# Altium schematic sheet IMU-SD Card-CAN-CH340.SchDoc
size A4; SheetNumber: 9; SheetTotal: 10
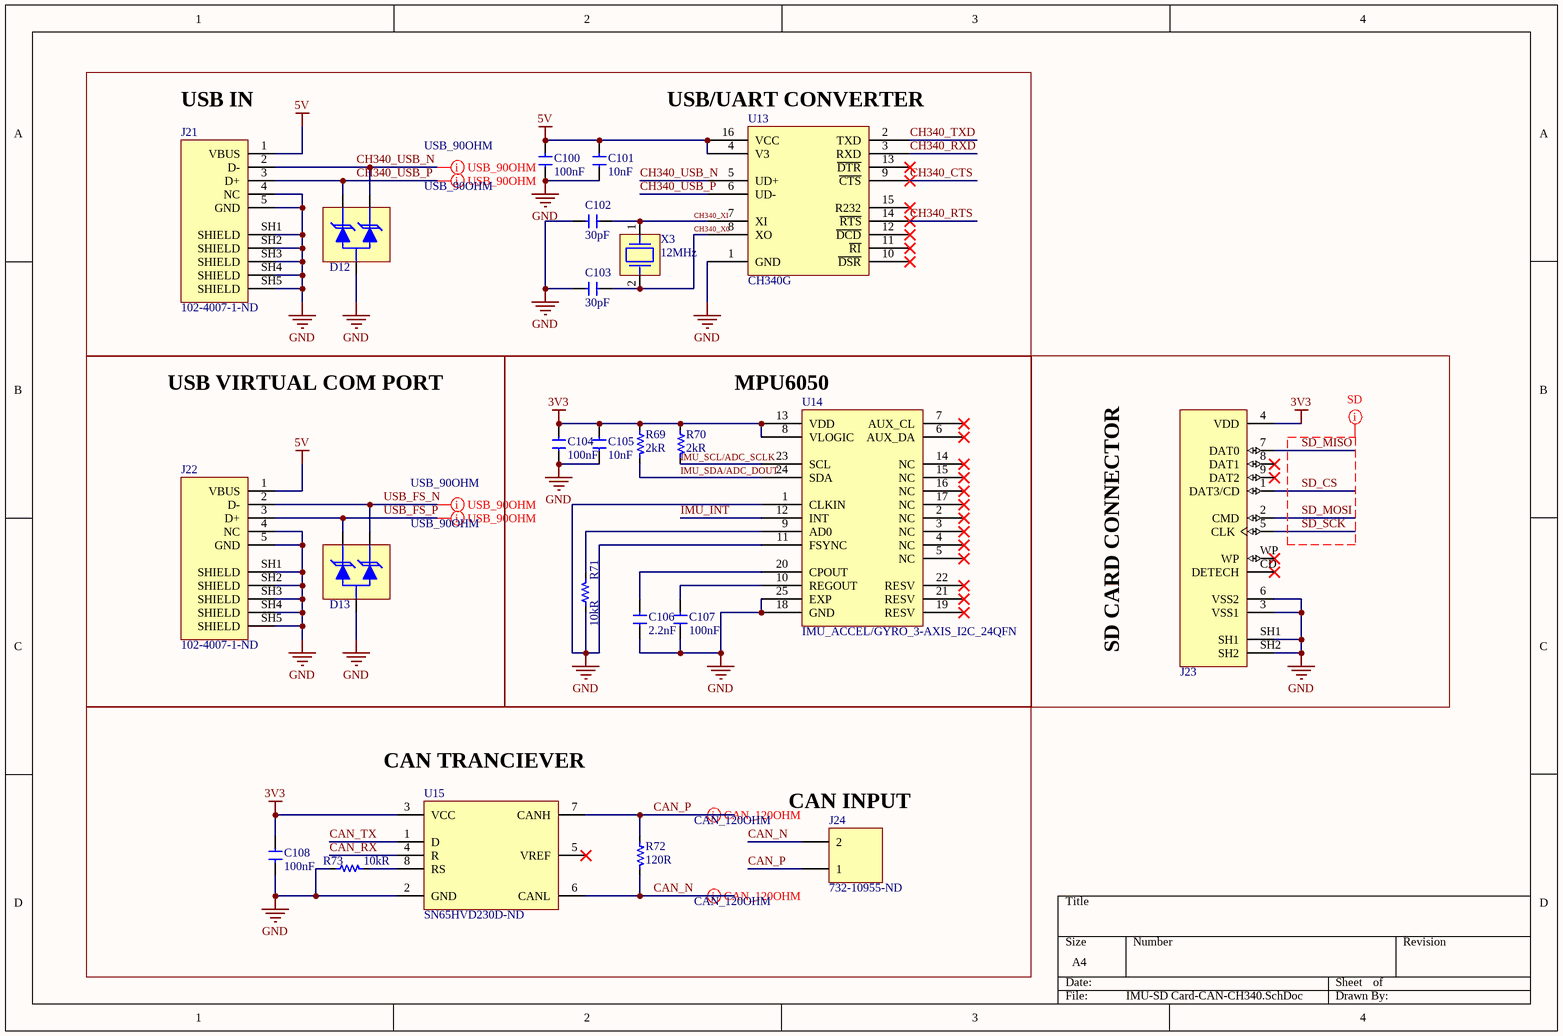
[diagram p0: IMU-SD Card-CAN-CH340.SchDoc]

## Parts
C100  Capacitance: 100nF  [0805_CAP]  (hidden comment: CAP_0.1uF_%20_50V_0805_X7R_CER)
C101  Capacitance: 10nF  [0805_CAP]  (hidden comment: CAP_10nF_%10_50V_0805_X7R_CER)
C102  Capacitance: 30pF  [0805_CAP]  (hidden comment: CAP_30pF_%5_50V_0805_C0G/NP0_CER)
C103  Capacitance: 30pF  [0805_CAP]  (hidden comment: CAP_30pF_%5_50V_0805_C0G/NP0_CER)
C104  Capacitance: 100nF  [0805_CAP]  (hidden comment: CAP_0.1uF_%20_50V_0805_X7R_CER)
C105  Capacitance: 10nF  [0805_CAP]  (hidden comment: CAP_10nF_%10_50V_0805_X7R_CER)
C106  Capacitance: 2.2nF  [0805_CAP]  (hidden comment: CAP_2200pF_%10_50V_0805_X7R_CER)
C107  Capacitance: 100nF  [0805_CAP]  (hidden comment: CAP_0.1uF_%20_50V_0805_X7R_CER)
C108  Capacitance: 100nF  [0805_CAP]  (hidden comment: CAP_0.1uF_%20_50V_0805_X7R_CER)
D12  DIODE_TVS_3.3VWM_8VC_SOT23  [SOT170P237X110-3N]  (value not drawn)
D13  DIODE_TVS_3.3VWM_8VC_SOT23  [SOT170P237X110-3N]  (value not drawn)
J21  Supplier Part Number 1: 102-4007-1-ND  [MICRO_USB2.0_CUI_UJ2-MIBH2-4-SMT]  (hidden comment: Micro USB2.0)
J22  Supplier Part Number 1: 102-4007-1-ND  [MICRO_USB2.0_CUI_UJ2-MIBH2-4-SMT]  (hidden comment: Micro USB2.0)
J23  CONN_SD CARD_L-KLS1-SD-001  [SD CARD L-KLS1-TF-003]  (value not drawn)
J24  Supplier Part Number 1: 732-10955-ND  [1x2_TERMINAL BLOCK]  (hidden comment: CONN_1X2_Terminal Block)
R69  Resistance: 2kR  [0805_RES]  (hidden comment: RES_2K OHM_1%_0805_1/8W_SMD)
R70  Resistance: 2kR  [0805_RES]  (hidden comment: RES_2K OHM_1%_0805_1/8W_SMD)
R71  Resistance: 10kR  [0805_RES]  (hidden comment: 10k Ohms)
R72  120R  [0805_RES]
R73  Resistance: 10kR  [0805_RES]  (hidden comment: 10k Ohms)
U13  CH340G  [SOIC127P600X180-16N]
U14  IMU_ACCEL/GYRO_3-AXIS_I2C_24QFN  [IC_MPU6050]
U15  Supplier Part Number 1: SN65HVD230D-ND  [SOIC127P599X175-8N]  (hidden comment: IC_TRANSCEIVER CAN_SN65HVD230D)
X3  Frequency: 12MHz  [HC-49/US]  (hidden comment: CRYSTAL_12MHz_20PF_SMD)

## Blocks framed on the sheet
USB VIRTUAL COM PORT: D13 J22
MPU6050: C104-C107 R69-R71 U14
SD CARD CONNECTOR: J23

## Nets
3V3: C104.2 C105.2 C108.2 J23.4(VDD) R69.2 R70.2 U14.8(VLOGIC) U14.13(VDD) U15.3(VCC)
5V: C100.2 C101.2 J21.1(VBUS) J22.1(VBUS) U13.4(V3) U13.16(VCC)
GND: C100.1 C101.1 C102.1 C103.1 C104.1 C105.1 C106.1 C107.1 C108.1 D12.3(ANODE) D13.3(ANODE) J21.4(NC) J21.5(GND) J21.SH1(SHIELD) J21.SH2(SHIELD) J21.SH3(SHIELD) J21.SH4(SHIELD) J21.SH5(SHIELD) J22.4(NC) J22.5(GND) J22.SH1(SHIELD) J22.SH2(SHIELD) J22.SH3(SHIELD) J22.SH4(SHIELD) J22.SH5(SHIELD) J23.3(VSS1) J23.6(VSS2) J23.SH1 J23.SH2 R71.2 R73.2 U13.1(GND) U14.1(CLKIN) U14.11(FSYNC) U14.18(GND) U14.25(EXP) U15.2(GND)
CAN_N: J24.2 R72.1 U15.6(CANL)
CAN_P: J24.1 R72.2 U15.7(CANH)
CAN_RX: U15.4(R)
CAN_TX: U15.1(D)
CH340_CTS: U13.9(~{CTS})
CH340_RTS: U13.14(~{RTS})
CH340_RXD: U13.3(RXD)
CH340_TXD: U13.2(TXD)
CH340_USB_N: D12.1(CATHODE_1) J21.2(D-) U13.5(UD+)
CH340_USB_P: D12.2(CATHODE_2) J21.3(D+) U13.6(UD-)
CH340_X0: C103.2 U13.8(XO) X3.2
CH340_XI: C102.2 U13.7(XI) X3.1
IMU_INT: U14.12(INT)
IMU_SCL/ADC_SCLK: R70.1 U14.23(SCL)
IMU_SDA/ADC_DOUT: R69.1 U14.24(SDA)
SD_CS: J23.1(DAT3/CD)
SD_MISO: J23.7(DAT0)
SD_MOSI: J23.2(CMD)
SD_SCK: J23.5(CLK)
USB_FS_N: D13.1(CATHODE_1) J22.2(D-)
USB_FS_P: D13.2(CATHODE_2) J22.3(D+)
NetC106_2: C106.2 U14.20(CPOUT)
NetC107_2: C107.2 U14.10(REGOUT)
NetR71_1: R71.1 U14.9(AD0)
NetR73_1: R73.1 U15.8(RS)

Not connected (* = marked no-connect by the designer): J23 8(DAT1)* 9(DAT2)* CD(DETECH)* WP*; U13 10(~{DSR})* 11(~{RI})* 12(~{DCD})* 13(~{DTR})* 15(R232)*; U14 2(NC)* 3(NC)* 4(NC)* 5(NC)* 6(AUX_DA)* 7(AUX_CL)* 14(NC)* 15(NC)* 16(NC)* 17(NC)* 19(RESV)* 21(RESV)* 22(RESV)*; U15 5(VREF)*

## Layout directives
differential pair; differential pair class CAN_120OHM: CAN_N, CAN_P
differential pair; differential pair class USB_90OHM: CH340_USB_N, CH340_USB_P, USB_FS_N, USB_FS_P
net class SD: SD_CS, SD_MISO, SD_MOSI, SD_SCK

## Notes on the sheet
- (near J21) USB IN
- (near U13) USB/UART CONVERTER
- (near U15) CAN TRANCIEVER
- (near J24) CAN INPUT

## Library data of the parts
C100 C104 C107 C108 = CAP_0.1uF_%20_50V_0805_X7R_CER: Cap Ceramic 0.1uF 50V X7R 20% SMD 0805 125C Paper T/R; Manufacturer: KEMET; Manufacturer Part Number: C0805C104M5RACTU; Supplier 1: Digi-Key; RoHS: Yes; Category: Ceramic Capacitors; Stock 1: 4863; Pricing 1: 1=0,10000, 10=0,06400, 50=0,03500, 100=0,02860, 500=0,02040, 1000=0,01603 (USD); Mount: Surface Mount; Case/Package: 0805; Dielectric Material: Ceramic; Min Operating Temperature: -55°C; Max Operating Temperature: 125°C; Tolerance: 20%; Dielectric: X7R; Packaging: Tape and Reel; Voltage Rating (DC): 50V; Length: 2mm; Height: 0.9mm; Depth: 1.25mm; Radiation Hardening: No; ComponentLink1URL: http://uk.rs-online.com/webdocs/13da/0900766b813daa06.pdf?src-supplier=RSComponents; ComponentLink1Description: http://uk.rs-online.com/webdocs/13da/0900766b813daa06.pdf?src-supplier=RSComponents; ComponentLink2URL: https://www.verical.com/server-webapp/html/getDatasheet?partID=774625&src-supplier=Verical; ComponentLink2Description: https://www.verical.com/server-webapp/html/getDatasheet?partID=774625&src-supplier=Verical; ComponentLink3URL: http://www.farnell.com/datasheets/2739857.pdf?src-supplier=Farnell; ComponentLink3Description: http://www.farnell.com/datasheets/2739857.pdf?src-supplier=Farnell; ComponentLink4URL: http://uk.rs-online.com/webdocs/1515/0900766b81515223.pdf?src-supplier=RSComponents; ComponentLink4Description: http://uk.rs-online.com/webdocs/1515/0900766b81515223.pdf?src-supplier=RSComponents; ComponentLink5URL: http://components.arrow.com/part/dataview/0323_00324812?src-supplier=Arrow+Europe; ComponentLink5Description: http://components.arrow.com/part/dataview/0323_00324812?src-supplier=Arrow+Europe; ComponentLink6URL: http://uk.rs-online.com/webdocs/1528/0900766b81528e2f.pdf?src-supplier=RSComponents; ComponentLink6Description: http://uk.rs-online.com/webdocs/1528/0900766b81528e2f.pdf?src-supplier=RSComponents; ComponentLink7URL: http://www.farnell.com/datasheets/2739857.pdf?src-supplier=Newark; ComponentLink7Description: http://www.farnell.com/datasheets/2739857.pdf?src-supplier=Newark; ComponentLink8URL: http://www.alliedelec.com/m/d/9bfe7773041ffe9d406e68bc7b377fdd.pdf?src-supplier=Allied+Electronics; ComponentLink8Description: http://www.alliedelec.com/m/d/9bfe7773041ffe9d406e68bc7b377fdd.pdf?src-supplier=Allied+Electronics; ComponentLink9URL: https://api.kemet.com/component-edge/download/datasheet/C0805C104M5RACTU.pdf?src-supplier=Digi-Key; ComponentLink9Description: https://api.kemet.com/component-edge/download/datasheet/C0805C104M5RACTU.pdf?src-supplier=Digi-Key; ComponentLink10URL: http://capacitoredge.kemet.com/capedge2/DataSheet?pn=C0805C104M5RACTU&src-supplier=Avnet+Europe; ComponentLink10Description: http://capacitoredge.kemet.com/capedge2/DataSheet?pn=C0805C104M5RACTU&src-supplier=Avnet+Europe; ComponentLink11URL: http://www.farnell.com/datasheets/2739857.pdf?src-supplier=Element14; ComponentLink11Description: http://www.farnell.com/datasheets/2739857.pdf?src-supplier=Element14; ComponentLink12URL: http://www.mouser.com/ds/2/212/KEM_C1002_X7R_SMD-1102033.pdf?src-supplier=Mouser; ComponentLink12Description: http://www.mouser.com/ds/2/212/KEM_C1002_X7R_SMD-1102033.pdf?src-supplier=Mouser; ComponentLink13URL: https://www.verical.com/server-webapp/html/getDatasheet?partID=91523&src-supplier=Verical; ComponentLink13Description: https://www.verical.com/server-webapp/html/getDatasheet?partID=91523&src-supplier=Verical; ComponentLink14URL: http://components.arrow.com/part/dataview/2091108S8109171N7429?src-supplier=Arrow+Electronics; ComponentLink14Description: http://components.arrow.com/part/dataview/2091108S8109171N7429?src-supplier=Arrow+Electronics; Supplier Part Number 1: 399-C0805C104M5RAC7800CT-ND
C101 C105 = CAP_10nF_%10_50V_0805_X7R_CER: CAP CER 10000PF 50V X7R 0805; Manufacturer: Samsung; Manufacturer Part Number: CL21B103KBANNNC; Material: Ceramic; Tolerance: 10%; Supplier 1: Digi-Key; RoHS: Yes; Category: Ceramic Capacitors; Stock 1: 1431273; Pricing 1: 1=0,10000, 10=0,04600, 50=0,02500, 100=0,02050, 500=0,01464, 1000=0,01150 (USD); Mount: Surface Mount; Case/Package: 0805; Case Code (Metric): 2012; Case Code (Imperial): 0805; Contact Plating: Tin; Min Operating Temperature: -55°C; Max Operating Temperature: 125°C; Dielectric: X7R; Voltage: 50V; Voltage Rating (DC): 50V; Packaging: Tape and Reel; Voltage Rating: 50V; Series: CL; Construction: Flat; Length: 2mm; Width: 0.049inch; Height: 0.65mm; Depth: 1.25mm; Thickness: 0.03inch; Radiation Hardening: No; Lead Free: Lead Free; RoHS Compliant: Yes; ComponentLink1URL: https://datasheet.ciiva.com/25709/cl21b103kbannnc-25709781.pdf?src-supplier=Digi-Key; ComponentLink1Description: https://datasheet.ciiva.com/25709/cl21b103kbannnc-25709781.pdf?src-supplier=Digi-Key; ComponentLink2URL: https://datasheet.ciiva.com/29199/455082-da-01-en-vs-kondensator-0805-29199459.pdf?src-supplier=Conrad; ComponentLink2Description: https://datasheet.ciiva.com/29199/455082-da-01-en-vs-kondensator-0805-29199459.pdf?src-supplier=Conrad; Supplier Part Number 1: 1276-1015-1-ND
C102 C103 = CAP_30pF_%5_50V_0805_C0G/NP0_CER: 0805 30 pF 50 V ±5% Tolerance C0G/NP0 Surface Mount Multilayer Ceramic Capacitor; Manufacturer: Kyocera AVX; Manufacturer Part Number: 08055A300JAT2A; Dielectric: C0G; Voltage Rating: 50V; Dissipation Factor: 10%; Insulation Resistance: 100GR; Supplier 1: Digi-Key; RoHS: Yes; Category: Ceramic Capacitors; Stock 1: 89499; Pricing 1: 1=0,15000, 10=0,10700, 50=0,06060, 100=0,05020, 500=0,03522, 1000=0,02916 (USD); Mount: Surface Mount; Case/Package: 0805; Number of Pins: 2; Case Code (Metric): 2012; Case Code (Imperial): 0805; Contact Plating: Tin,Matte; Min Operating Temperature: -55°C; Max Operating Temperature: 125°C; Tolerance: 5%; Package Quantity: 4000; Packaging: Tape and Reel; Voltage Rating (DC): 50V; Termination: SMD/SMT; Series: -; Construction: Flat; Length: 2.01mm; Width: 0.049inch; Height: 0.94mm; Depth: 1.25mm; Thickness: 0.037inch; Radiation Hardening: No; Lead Free: Lead Free; RoHS Compliant: Yes; ComponentLink1URL: https://datasheet.ciiva.com/26904/getdatasheetpartid-55917-26904215.pdf?src-supplier=Verical; ComponentLink1Description: https://datasheet.ciiva.com/26904/getdatasheetpartid-55917-26904215.pdf?src-supplier=Verical; ComponentLink2URL: https://datasheet.ciiva.com/204/ccog-204694.pdf?src-supplier=Digi-Key; ComponentLink2Description: https://datasheet.ciiva.com/204/ccog-204694.pdf?src-supplier=Digi-Key; ComponentLink3URL: https://datasheet.ciiva.com/5413/ccog-243403-5413334.pdf?src-supplier=Mouser; ComponentLink3Description: https://datasheet.ciiva.com/5413/ccog-243403-5413334.pdf?src-supplier=Mouser; ComponentLink4URL: https://datasheet.ciiva.com/16201/ccog-16201638.pdf?src-supplier=Future+Electronics; ComponentLink4Description: https://datasheet.ciiva.com/16201/ccog-16201638.pdf?src-supplier=Future+Electronics; ComponentLink5URL: https://datasheet.ciiva.com/11545/ccog-11545755.pdf?src-supplier=Avnet; ComponentLink5Description: https://datasheet.ciiva.com/11545/ccog-11545755.pdf?src-supplier=Avnet; Supplier Part Number 1: 478-12776-1-ND
C106 = CAP_2200pF_%10_50V_0805_X7R_CER: 贴片陶瓷电容  2.2nF ±10% 50V X7R 0805; Manufacturer: Samsung; Manufacturer Part Number: CL21B222KBANNNC; Material: Ceramic; Supplier 1: Digi-Key; RoHS: Yes; Category: Ceramic Capacitors; Stock 1: 162831; Pricing 1: 1=0,10000, 10=0,04600, 50=0,02480, 100=0,02030, 500=0,01452, 1000=0,01140 (USD); Mount: Surface Mount; Case/Package: 0805; Case Code (Metric): 2012; Case Code (Imperial): 0805; Contact Plating: Tin; Min Operating Temperature: -55°C; Max Operating Temperature: 125°C; Tolerance: 10%; Dielectric: X7R; Packaging: Tape and Reel; Package Quantity: 1; Voltage Rating: 50V; Voltage: 50V; Series: CL; Construction: Flat; Length: 2mm; Width: 0.049inch; Height: 0.65mm; Depth: 1.25mm; Thickness: 0.03inch; Radiation Hardening: No; RoHS Compliant: Yes; ComponentLink1URL: https://datasheet.ciiva.com/25802/cl21b222kbannnc-25802100.pdf?src-supplier=Digi-Key; ComponentLink1Description: https://datasheet.ciiva.com/25802/cl21b222kbannnc-25802100.pdf?src-supplier=Digi-Key; ComponentLink2URL: https://datasheet.ciiva.com/26838/getdatasheetpartid-640852-26838689.pdf?src-supplier=Verical; ComponentLink2Description: https://datasheet.ciiva.com/26838/getdatasheetpartid-640852-26838689.pdf?src-supplier=Verical; ComponentLink3URL: https://datasheet.ciiva.com/29199/455716-da-01-en-vs-kondensator-0805-29199282.pdf?src-supplier=Conrad; ComponentLink3Description: https://datasheet.ciiva.com/29199/455716-da-01-en-vs-kondensator-0805-29199282.pdf?src-supplier=Conrad; ComponentLink4URL: https://datasheet.ciiva.com/16199/cl05b104kq5nnnc-16199209.pdf?src-supplier=Future+Electronics; ComponentLink4Description: https://datasheet.ciiva.com/16199/cl05b104kq5nnnc-16199209.pdf?src-supplier=Future+Electronics; Supplier Part Number 1: 1276-1171-1-ND
D12 D13 = DIODE_TVS_3.3VWM_8VC_SOT23: ESD Suppressor TVS Uni-Dir 3.3V 3-Pin SOT-23 T/R; Manufacturer: MCC; Manufacturer Part Number: ESD3V3AP-TP; Number of Unidirectional Channels: 2; Min Breakdown Voltage: 5V; Clamping Voltage: 7.5V; Peak Pulse Current: 13.3A; Peak Pulse Power: 300W; Power Line Protection: No; Supplier 1: Digi-Key; RoHS: Yes; Category: TVS Diodes; Stock 1: 509; Pricing 1: 1=0,35000, 10=0,26400, 100=0,14950, 500=0,09900, 1000=0,07590 (USD); Mount: Surface Mount; Case/Package: TO-236-3; Min Operating Temperature: -55°C; Max Operating Temperature: 150°C; Resistor Type: Zener; Packaging: Tape and Reel; Reverse Standoff Voltage: 3.3V; RoHS Compliant: Yes; ComponentLink1URL: http://www.mccsemi.com/up_pdf/ESD3V3AP(SOT-23).pdf?src-supplier=Digi-Key; ComponentLink1Description: http://www.mccsemi.com/up_pdf/ESD3V3AP(SOT-23).pdf?src-supplier=Digi-Key; ComponentLink2URL: https://www.mccsemi.com/pdf/Products/ESD3V3AP(SOT-23).pdf?src-supplier=Digi-Key; ComponentLink2Description: https://www.mccsemi.com/pdf/Products/ESD3V3AP(SOT-23).pdf?src-supplier=Digi-Key; Supplier Part Number 1: ESD3V3AP-TPMSCT-ND
J21 J22 = CONN_RCPT_USB2.0_MICRO B_SMD_R/A: Conn Micro USB 2.0 Type B F 5 POS 0.65mm Solder RA SMD 5 Terminal 1 Port T/R; Manufacturer: CUI Devices; Manufacturer Part Number: UJ2-MIBH2-4-SMT-TR; Supplier 1: Digi-Key; RoHS: No; Category: Connectors; Stock 1: 48589; Pricing 1: 1=0,87000, 10=0,73800, 25=0,70800, 50=0,69320, 100=0,66300, 250=0,60272, 500=0,54244 (USD)
J23 = CONN_SD CARD_L-KLS1-SD-001: Conn; IC Socket; SD Memory Card; Push/Push; SD Ser.; MF: {'manufacturer': u'Amphenol ICC (Commercial Products)'}; MP: 101003136802; Value: *; Availability: Unavailable; Package: None; Price: None
J24 = CONN_1X2_Terminal Block: Series 1377 - 5.00 mm Horizontal Entry with Pressure Clamp WR-TBL, 2 pin; Manufacturer: Wurth Electronics; Manufacturer Part Number: 691137710002; Plating: Copper Alloy; Number of Levels: 1; Number of Positions Per Level: 2; Current: 16A; Voltage: 300V; Wire Gauge (Max): 30AWG; Wire Gauge (Min): 12AWG; Supplier 1: Digi-Key; RoHS: No; Category: Terminal Blocks; Stock 1: 10587; Pricing 1: 1=0,39000, 10=0,35200, 50=0,31100, 100=0,27900, 500=0,26900 (USD); Mount: Through Hole; Color: Green; Housing Material: PC; Min Operating Temperature: -30°C; Max Operating Temperature: 120°C; Packaging: Bulk; Termination: Screw; ComponentLink1URL: https://katalog.we-online.de/em/datasheet/691137710002.pdf?src-supplier=Digi-Key; ComponentLink1Description: https://katalog.we-online.de/em/datasheet/691137710002.pdf?src-supplier=Digi-Key
R69 R70 = RES_2K OHM_1%_0805_1/8W_SMD: Res Thick Film 0805 2K Ohm 1% 0.125W(1/8W) ±100ppm/C Pad SMD Automotive T/R; Manufacturer: Yageo; Manufacturer Part Number: AC0805FR-072KL; Voltage Rating: 150V; Power Rating: 125mW; Temperature Coefficient: 100ppm/°C; Supplier 1: Digi-Key; RoHS: Yes; Category: Chip SMD Resistors; Stock 1: 98521; Pricing 1: 1=0,10000, 10=0,05000, 100=0,02040, 1000=0,00917, 2500=0,00796 (USD); Case/Package: 0805; Case Code (Imperial): 0805; Case Code (Metric): 2012; Weight: 0.000194oz; Min Operating Temperature: -55°C; Max Operating Temperature: 155°C; Packaging: Tape and Reel; Tolerance: 1%; Resistor Type: Thick Film; Termination: SMD/SMT; Number of Terminations: 2; Max Power Dissipation: 125mW; Features: Moisture Resistant,Automotive AEC-Q200; Series: AC; Length: 0.079inch; Width: 1.25mm; Height: 0.024inch; RoHS Compliant: Yes; ComponentLink1URL: https://datasheet.ciiva.com/12576/pyu-ac-51-rohs-l-2-12576581.pdf?src-supplier=Mouser; ComponentLink1Description: https://datasheet.ciiva.com/12576/pyu-ac-51-rohs-l-2-12576581.pdf?src-supplier=Mouser; Supplier Part Number 1: YAG3718CT-ND
R71 R73 = RES_10K OHM_%1_0805_1/8W: Res SMD 0805 10K 1% 0.125W T.C.100PPM; Manufacturer: TDK; Manufacturer Part Number: C2012X7R1H104K085AA; Dielectric Material: Ceramic; Capacitance: 100nF; Tolerance: 10%; Dielectric: X7R; Voltage Rating: 50V; Temperature Coefficient: 100ppm/°C; Power Rating: 125mW; Supplier 1: Digi-Key; RoHS: Yes; Category: Ceramic Capacitors; Stock 1: 54853; Pricing 1: 1=0,15000, 10=0,10900, 50=0,06160, 100=0,05100, 500=0,03578, 1000=0,02962 (USD); Mount: Surface Mount; Case/Package: 0805; Number of Pins: 2; Case Code (Metric): 2012; Case Code (Imperial): 0805; Weight: 0.000194oz; Min Operating Temperature: -55°C; Max Operating Temperature: 125°C; Packaging: Tape and Reel; Voltage Rating (DC): 50V; Termination: SMD/SMT; Construction: Flat; Package Quantity: 1; Resistor Type: Ceramic; Voltage: 50V; Series: C; Length: 2mm; Width: 0.049inch; Height: 0.85mm; Depth: 1.25mm; Thickness: 0.037inch; Radiation Hardening: No; RoHS Compliant: Yes; REACH SVHC: No SVHC; Lead Free: Lead Free; ComponentLink1URL: https://datasheet.ciiva.com/11788/0900766b80c1bb00-11788128.pdf?src-supplier=RSComponents; ComponentLink1Description: https://datasheet.ciiva.com/11788/0900766b80c1bb00-11788128.pdf?src-supplier=RSComponents; ComponentLink2URL: https://datasheet.ciiva.com/6250/tdkmlcccaprange-6250821.pdf?src-supplier=Digi-Key; ComponentLink2Description: https://datasheet.ciiva.com/6250/tdkmlcccaprange-6250821.pdf?src-supplier=Digi-Key; ComponentLink3URL: https://datasheet.ciiva.com/24191/e412-c-24191447.pdf?src-supplier=Future+Electronics; ComponentLink3Description: https://datasheet.ciiva.com/24191/e412-c-24191447.pdf?src-supplier=Future+Electronics; ComponentLink4URL: https://datasheet.ciiva.com/6250/tdkmlcccaprange-6250824.pdf?src-supplier=Digi-Key; ComponentLink4Description: https://datasheet.ciiva.com/6250/tdkmlcccaprange-6250824.pdf?src-supplier=Digi-Key; ComponentLink5URL: https://datasheet.ciiva.com/23803/1796654-23803035.pdf?src-supplier=Newark; ComponentLink5Description: https://datasheet.ciiva.com/23803/1796654-23803035.pdf?src-supplier=Newark; ComponentLink6URL: https://datasheet.ciiva.com/28602/1571323-28602204.pdf?src-supplier=Element14; ComponentLink6Description: https://datasheet.ciiva.com/28602/1571323-28602204.pdf?src-supplier=Element14; Supplier Part Number 1: 445-7534-1-ND; Supplier 2: Digi-Key; Stock 2: 3512962; Pricing 2: 1=0,10000, 10=0,04200, 100=0,01690, 1000=0,00759, 2500=0,00659 (USD); Size Code: 0805; Number of Terminations: 2; Max Power Dissipation: 125mW; Features: Moisture Resistant; Resistance Tolerance: 1%; Technology: THICK FILM; Military Standard: Not; Supplier Part Number 2: 311-10.0KCRCT-ND
R72 = RES_120 OHM_1%_0805_1/8W: Res Thick Film 0805 120 Ohm 1% 0.125W(1/8W) ±100ppm/C Pad SMD T/R; Manufacturer: Vishay; Manufacturer Part Number: CRCW0805120RFKEAC; Max Power Dissipation: 125mW; Temperature Coefficient: 100ppm/°C; Supplier 1: Digi-Key; Category: Chip SMD Resistors; Stock 1: 86753; Pricing 1: 1=0,10000, 10=0,06300, 100=0,02540, 1000=0,01143, 2500=0,00992 (USD); Case/Package: 0805; Min Operating Temperature: -55°C; Max Operating Temperature: 155°C; Resistor Type: Thick Film; Packaging: Tape and Reel; Resistance: 120R; Tolerance: 1%; Number of Terminations: 2; RoHS Compliant: Yes; ComponentLink1URL: http://www.vishay.com/docs/28773/crcwce3.pdf?src-supplier=Digi-Key; ComponentLink1Description: http://www.vishay.com/docs/28773/crcwce3.pdf?src-supplier=Digi-Key; Supplier Part Number 1: 541-CRCW0805120RFKEACCT-ND
U13 = IC_USB/UART_CH340G: USB to UART Converter IC; Manufacturer: WCH; Operating Supply Voltage: 3.3V; Interface: USB Serial; Package/Case: SOIC16
U14 = IMU_ACCEL/GYRO_3-AXIS_I2C_24QFN: IMU ACCEL/GYRO 3-AXIS I2C 24QFN; Manufacturer: TDK InvenSense; Sensor Type: Accelerometer,Gyroscope,3 Axis; Supplier 1: Digi-Key; Manufacturer Part Number: MPU-6050; RoHS: Yes; Category: Inertial Measurement Units (IMUs); Mount: Surface Mount; Case/Package: QFN; Min Operating Temperature: -40°C; Max Operating Temperature: 85°C; Packaging: Tape and Reel; Output Type: I2C; Series: -; RoHS Compliant: Yes; ComponentLink1URL: https://datasheet.ciiva.com/1513/1788002-1513632.pdf?src-supplier=Element14; ComponentLink1Description: https://datasheet.ciiva.com/1513/1788002-1513632.pdf?src-supplier=Element14; ComponentLink2URL: https://datasheet.ciiva.com/22731/1788002-22731434.pdf?src-supplier=Element14; ComponentLink2Description: https://datasheet.ciiva.com/22731/1788002-22731434.pdf?src-supplier=Element14; Supplier Part Number 1: 1428-1007-1-ND
U15 = IC_TRANSCEIVER CAN_SN65HVD230D: SN65HVD230 3.3 V Can Transceiver; Manufacturer: Texas Instruments; Data Rate: 1Mbps; Min Supply Voltage: 3V; Max Supply Voltage: 3.6V; Operating Supply Voltage: 3.3V; Nominal Supply Current: 17mA; Number of Transmit Buffers: 1; Supplier 1: Digi-Key; Manufacturer Part Number: SN65HVD230D; RoHS: Yes; Category: Logic ICs; Pricing 1: 1=3,17000, 10=2,84600, 25=2,69040, 100=2,33160, 250=2,21200, 500=1,98482, 1000=1,97400 (USD); Case/Package: D; Number of Pins: 8; Weight: 0.002561oz; Min Operating Temperature: -40°C; Max Operating Temperature: 85°C; Package Quantity: 75; Packaging: Rail/Tube; Number of Receive Buffers: 1; Number of Transceivers: 1; Max Supply Current: 17mA; Number of Drivers: 1; Number of Receivers: 1; Series: -; Supply Current: 17mA; Length: 4.9mm; Width: 3.91mm; Height: 1.58mm; Radiation Hardening: No; REACH SVHC: No SVHC; Lead Free: Lead Free; RoHS Compliant: Yes; ComponentLink1URL: https://datasheet.ciiva.com/19483/1372594-19483181.pdf?src-supplier=Jameco; ComponentLink1Description: https://datasheet.ciiva.com/19483/1372594-19483181.pdf?src-supplier=Jameco; ComponentLink2URL: https://datasheet.ciiva.com/41460/001187809-da-01-en-ic-can-transceive-sn65hvd230d-soic-8-tid-41460692.pdf?src-supplier=Conrad; ComponentLink2Description: https://datasheet.ciiva.com/41460/001187809-da-01-en-ic-can-transceive-sn65hvd230d-soic-8-tid-41460692.pdf?src-supplier=Conrad; ComponentLink3URL: https://datasheet.ciiva.com/1495/1818543-1495176.pdf?src-supplier=Element14; ComponentLink3Description: https://datasheet.ciiva.com/1495/1818543-1495176.pdf?src-supplier=Element14; ComponentLink4URL: https://datasheet.ciiva.com/15149/getdatasheetpartid-258990-15149989.pdf?src-supplier=Verical; ComponentLink4Description: https://datasheet.ciiva.com/15149/getdatasheetpartid-258990-15149989.pdf?src-supplier=Verical
X3 = CRYSTAL_12MHz_20PF_SMD: Crystal 12MHz ±25ppm (Tol) ±35ppm (Stability) 20pF FUND 50Ohm 2-Pin HC-49/US SMD T/R; Manufacturer: Abracon; Manufacturer Part Number: ABLS-12.000MHZ-20-B-3-H-T; Supplier 1: Digi-Key; RoHS: Yes; Category: Crystals; Stock 1: 3774; Pricing 1: 1=0,19000, 10=0,16100, 50=0,14480, 100=0,12860, 500=0,12220 (USD); ComponentLink1URL: https://abracon.com/Resonators/abls.pdf?src-supplier=Digi-Key; ComponentLink1Description: https://abracon.com/Resonators/abls.pdf?src-supplier=Digi-Key; Supplier Part Number 1: 535-15006-1-ND; Load Capacitance: 20pF